# Altium project R Box.PrjPcb
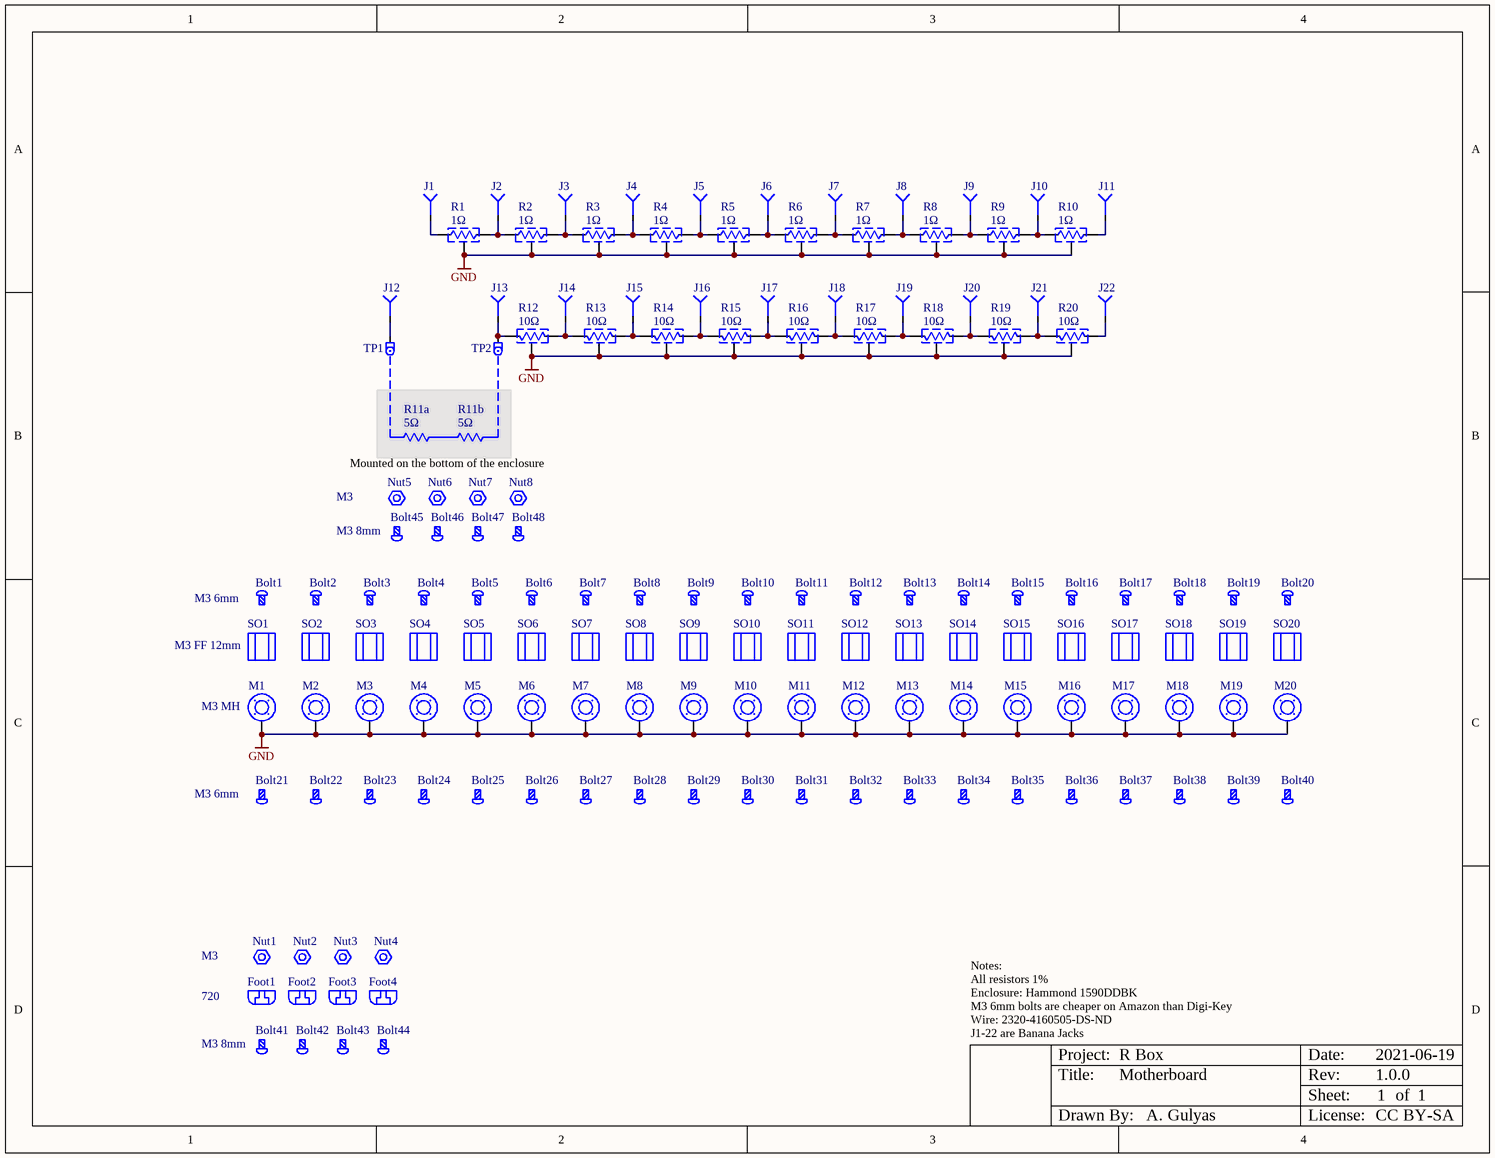
[diagram p0: R Box.SchDoc]
Revision: 1.0.0
1 sheet, 145 parts. Net scope: global (net labels, ports and power ports of the same name join across sheets).
Board file: R Box.PcbDoc

## Sheet R Box.SchDoc
size Letter; Revision: 1.0.0; SheetNumber: 1; SheetTotal: 1

### Parts
Bolt1  M3 6mm  [Mech - Bolt - M3 - 6mm]
Bolt2  M3 6mm  [Mech - Bolt - M3 - 6mm]  (value not drawn)
Bolt3  M3 6mm  [Mech - Bolt - M3 - 6mm]  (value not drawn)
Bolt4  M3 6mm  [Mech - Bolt - M3 - 6mm]  (value not drawn)
Bolt5  M3 6mm  [Mech - Bolt - M3 - 6mm]  (value not drawn)
Bolt6  M3 6mm  [Mech - Bolt - M3 - 6mm]  (value not drawn)
Bolt7  M3 6mm  [Mech - Bolt - M3 - 6mm]  (value not drawn)
Bolt8  M3 6mm  [Mech - Bolt - M3 - 6mm]  (value not drawn)
Bolt9  M3 6mm  [Mech - Bolt - M3 - 6mm]  (value not drawn)
Bolt10  M3 6mm  [Mech - Bolt - M3 - 6mm]  (value not drawn)
Bolt11  M3 6mm  [Mech - Bolt - M3 - 6mm]  (value not drawn)
Bolt12  M3 6mm  [Mech - Bolt - M3 - 6mm]  (value not drawn)
Bolt13  M3 6mm  [Mech - Bolt - M3 - 6mm]  (value not drawn)
Bolt14  M3 6mm  [Mech - Bolt - M3 - 6mm]  (value not drawn)
Bolt15  M3 6mm  [Mech - Bolt - M3 - 6mm]  (value not drawn)
Bolt16  M3 6mm  [Mech - Bolt - M3 - 6mm]  (value not drawn)
Bolt17  M3 6mm  [Mech - Bolt - M3 - 6mm]  (value not drawn)
Bolt18  M3 6mm  [Mech - Bolt - M3 - 6mm]  (value not drawn)
Bolt19  M3 6mm  [Mech - Bolt - M3 - 6mm]  (value not drawn)
Bolt20  M3 6mm  [Mech - Bolt - M3 - 6mm]  (value not drawn)
Bolt21  M3 6mm  [Mech - Bolt - M3 - 6mm - back]
Bolt22  M3 6mm  [Mech - Bolt - M3 - 6mm - back]  (value not drawn)
Bolt23  M3 6mm  [Mech - Bolt - M3 - 6mm - back]  (value not drawn)
Bolt24  M3 6mm  [Mech - Bolt - M3 - 6mm - back]  (value not drawn)
Bolt25  M3 6mm  [Mech - Bolt - M3 - 6mm - back]  (value not drawn)
Bolt26  M3 6mm  [Mech - Bolt - M3 - 6mm - back]  (value not drawn)
Bolt27  M3 6mm  [Mech - Bolt - M3 - 6mm - back]  (value not drawn)
Bolt28  M3 6mm  [Mech - Bolt - M3 - 6mm - back]  (value not drawn)
Bolt29  M3 6mm  [Mech - Bolt - M3 - 6mm - back]  (value not drawn)
Bolt30  M3 6mm  [Mech - Bolt - M3 - 6mm - back]  (value not drawn)
Bolt31  M3 6mm  [Mech - Bolt - M3 - 6mm - back]  (value not drawn)
Bolt32  M3 6mm  [Mech - Bolt - M3 - 6mm - back]  (value not drawn)
Bolt33  M3 6mm  [Mech - Bolt - M3 - 6mm - back]  (value not drawn)
Bolt34  M3 6mm  [Mech - Bolt - M3 - 6mm - back]  (value not drawn)
Bolt35  M3 6mm  [Mech - Bolt - M3 - 6mm - back]  (value not drawn)
Bolt36  M3 6mm  [Mech - Bolt - M3 - 6mm - back]  (value not drawn)
Bolt37  M3 6mm  [Mech - Bolt - M3 - 6mm - back]  (value not drawn)
Bolt38  M3 6mm  [Mech - Bolt - M3 - 6mm - back]  (value not drawn)
Bolt39  M3 6mm  [Mech - Bolt - M3 - 6mm - back]  (value not drawn)
Bolt40  M3 6mm  [Mech - Bolt - M3 - 6mm - back]  (value not drawn)
Bolt41  M3 8mm  [Mech - Bolt - M3 - 8mm]
Bolt42  M3 8mm  [Mech - Bolt - M3 - 8mm]  (value not drawn)
Bolt43  M3 8mm  [Mech - Bolt - M3 - 8mm]  (value not drawn)
Bolt44  M3 8mm  [Mech - Bolt - M3 - 8mm]  (value not drawn)
Bolt45  M3 8mm  [Mech - Bolt - M3 - 8mm]
Bolt46  M3 8mm  [Mech - Bolt - M3 - 8mm]  (value not drawn)
Bolt47  M3 8mm  [Mech - Bolt - M3 - 8mm]  (value not drawn)
Bolt48  M3 8mm  [Mech - Bolt - M3 - 8mm]  (value not drawn)
Foot1  720  [Feet - M3 - PN720]
Foot2  720  [Feet - M3 - PN720]  (value not drawn)
Foot3  720  [Feet - M3 - PN720]  (value not drawn)
Foot4  720  [Feet - M3 - PN720]  (value not drawn)
J1  Banana  [J - Banana - 108-09xx series]  (value not drawn)
J2  Banana  [J - Banana - 108-09xx series]  (value not drawn)
J3  Banana  [J - Banana - 108-09xx series]  (value not drawn)
J4  Banana  [J - Banana - 108-09xx series]  (value not drawn)
J5  Banana  [J - Banana - 108-09xx series]  (value not drawn)
J6  Banana  [J - Banana - 108-09xx series]  (value not drawn)
J7  Banana  [J - Banana - 108-09xx series]  (value not drawn)
J8  Banana  [J - Banana - 108-09xx series]  (value not drawn)
J9  Banana  [J - Banana - 108-09xx series]  (value not drawn)
J10  Banana  [J - Banana - 108-09xx series]  (value not drawn)
J11  Banana  [J - Banana - 108-09xx series]  (value not drawn)
J12  Banana  [J - Banana - 108-09xx series]  (value not drawn)
J13  Banana  [J - Banana - 108-09xx series]  (value not drawn)
J14  Banana  [J - Banana - 108-09xx series]  (value not drawn)
J15  Banana  [J - Banana - 108-09xx series]  (value not drawn)
J16  Banana  [J - Banana - 108-09xx series]  (value not drawn)
J17  Banana  [J - Banana - 108-09xx series]  (value not drawn)
J18  Banana  [J - Banana - 108-09xx series]  (value not drawn)
J19  Banana  [J - Banana - 108-09xx series]  (value not drawn)
J20  Banana  [J - Banana - 108-09xx series]  (value not drawn)
J21  Banana  [J - Banana - 108-09xx series]  (value not drawn)
J22  Banana  [J - Banana - 108-09xx series]  (value not drawn)
M1  M3 MH  [Bolt Hole - M3]  (no BOM)
M2  M3 MH  [Bolt Hole - M3]  (value not drawn)  (no BOM)
M3  M3 MH  [Bolt Hole - M3]  (value not drawn)  (no BOM)
M4  M3 MH  [Bolt Hole - M3]  (value not drawn)  (no BOM)
M5  M3 MH  [Bolt Hole - M3]  (value not drawn)  (no BOM)
M6  M3 MH  [Bolt Hole - M3]  (value not drawn)  (no BOM)
M7  M3 MH  [Bolt Hole - M3]  (value not drawn)  (no BOM)
M8  M3 MH  [Bolt Hole - M3]  (value not drawn)  (no BOM)
M9  M3 MH  [Bolt Hole - M3]  (value not drawn)  (no BOM)
M10  M3 MH  [Bolt Hole - M3]  (value not drawn)  (no BOM)
M11  M3 MH  [Bolt Hole - M3]  (value not drawn)  (no BOM)
M12  M3 MH  [Bolt Hole - M3]  (value not drawn)  (no BOM)
M13  M3 MH  [Bolt Hole - M3]  (value not drawn)  (no BOM)
M14  M3 MH  [Bolt Hole - M3]  (value not drawn)  (no BOM)
M15  M3 MH  [Bolt Hole - M3]  (value not drawn)  (no BOM)
M16  M3 MH  [Bolt Hole - M3]  (value not drawn)  (no BOM)
M17  M3 MH  [Bolt Hole - M3]  (value not drawn)  (no BOM)
M18  M3 MH  [Bolt Hole - M3]  (value not drawn)  (no BOM)
M19  M3 MH  [Bolt Hole - M3]  (value not drawn)  (no BOM)
M20  M3 MH  [Bolt Hole - M3]  (value not drawn)  (no BOM)
Nut1  M3  [Mech - Nut - M3]
Nut2  M3  [Mech - Nut - M3]  (value not drawn)
Nut3  M3  [Mech - Nut - M3]  (value not drawn)
Nut4  M3  [Mech - Nut - M3]  (value not drawn)
Nut5  M3  [Mech - Nut - M3]
Nut6  M3  [Mech - Nut - M3]  (value not drawn)
Nut7  M3  [Mech - Nut - M3]  (value not drawn)
Nut8  M3  [Mech - Nut - M3]  (value not drawn)
R1  1Ω  [R - PWR163]
R2  1Ω  [R - PWR163]
R3  1Ω  [R - PWR163]
R4  1Ω  [R - PWR163]
R5  1Ω  [R - PWR163]
R6  1Ω  [R - PWR163]
R7  1Ω  [R - PWR163]
R8  1Ω  [R - PWR163]
R9  1Ω  [R - PWR163]
R10  1Ω  [R - PWR163]
R11a  5Ω  [R - KAL50W]
R11b  5Ω  [R - KAL50W]
R12  10Ω  [R - PWR163]
R13  10Ω  [R - PWR163]
R14  10Ω  [R - PWR163]
R15  10Ω  [R - PWR163]
R16  10Ω  [R - PWR163]
R17  10Ω  [R - PWR163]
R18  10Ω  [R - PWR163]
R19  10Ω  [R - PWR163]
R20  10Ω  [R - PWR163]
SO1  M3 FF 12mm  [Mech - SO - M3 - FF - 12mm]
SO2  M3 FF 12mm  [Mech - SO - M3 - FF - 12mm]  (value not drawn)
SO3  M3 FF 12mm  [Mech - SO - M3 - FF - 12mm]  (value not drawn)
SO4  M3 FF 12mm  [Mech - SO - M3 - FF - 12mm]  (value not drawn)
SO5  M3 FF 12mm  [Mech - SO - M3 - FF - 12mm]  (value not drawn)
SO6  M3 FF 12mm  [Mech - SO - M3 - FF - 12mm]  (value not drawn)
SO7  M3 FF 12mm  [Mech - SO - M3 - FF - 12mm]  (value not drawn)
SO8  M3 FF 12mm  [Mech - SO - M3 - FF - 12mm]  (value not drawn)
SO9  M3 FF 12mm  [Mech - SO - M3 - FF - 12mm]  (value not drawn)
SO10  M3 FF 12mm  [Mech - SO - M3 - FF - 12mm]  (value not drawn)
SO11  M3 FF 12mm  [Mech - SO - M3 - FF - 12mm]  (value not drawn)
SO12  M3 FF 12mm  [Mech - SO - M3 - FF - 12mm]  (value not drawn)
SO13  M3 FF 12mm  [Mech - SO - M3 - FF - 12mm]  (value not drawn)
SO14  M3 FF 12mm  [Mech - SO - M3 - FF - 12mm]  (value not drawn)
SO15  M3 FF 12mm  [Mech - SO - M3 - FF - 12mm]  (value not drawn)
SO16  M3 FF 12mm  [Mech - SO - M3 - FF - 12mm]  (value not drawn)
SO17  M3 FF 12mm  [Mech - SO - M3 - FF - 12mm]  (value not drawn)
SO18  M3 FF 12mm  [Mech - SO - M3 - FF - 12mm]  (value not drawn)
SO19  M3 FF 12mm  [Mech - SO - M3 - FF - 12mm]  (value not drawn)
SO20  M3 FF 12mm  [Mech - SO - M3 - FF - 12mm]  (value not drawn)
TP1  Signal  [TP - TH - 4mm]  (value not drawn)  (no BOM)
TP2  Signal  [TP - TH - 4mm]  (value not drawn)  (no BOM)

### Nets
GND: M1.1 M2.1 M3.1 M4.1 M5.1 M6.1 M7.1 M8.1 M9.1 M10.1 M11.1 M12.1 M13.1 M14.1 M15.1 M16.1 M17.1 M18.1 M19.1 M20.1 R1.0 R2.0 R3.0 R4.0 R5.0 R6.0 R7.0 R8.0 R9.0 R10.0 R12.0 R13.0 R14.0 R15.0 R16.0 R17.0 R18.0 R19.0 R20.0
NetJ1_1: J1.1 R1.1
NetJ2_1: J2.1 R1.2 R2.1
NetJ3_1: J3.1 R2.2 R3.1
NetJ4_1: J4.1 R3.2 R4.1
NetJ5_1: J5.1 R4.2 R5.1
NetJ6_1: J6.1 R5.2 R6.1
NetJ7_1: J7.1 R6.2 R7.1
NetJ8_1: J8.1 R7.2 R8.1
NetJ9_1: J9.1 R8.2 R9.1
NetJ10_1: J10.1 R9.2 R10.1
NetJ11_1: J11.1 R10.2
NetJ12_1: J12.1 TP1.1
NetJ13_1: J13.1 R12.2 TP2.1
NetJ14_1: J14.1 R12.1 R13.2
NetJ15_1: J15.1 R13.1 R14.2
NetJ16_1: J16.1 R14.1 R15.2
NetJ17_1: J17.1 R15.1 R16.2
NetJ18_1: J18.1 R16.1 R17.2
NetJ19_1: J19.1 R17.1 R18.2
NetJ20_1: J20.1 R18.1 R19.2
NetJ21_1: J21.1 R19.1 R20.2
NetJ22_1: J22.1 R20.1

### Notes on the sheet
- Mounted on the bottom of the enclosure
- Notes:
  All resistors 1%
  Enclosure: Hammond 1590DDBK
  M3 6mm bolts are cheaper on Amazon than Digi-Key
  Wire: 2320-4160505-DS-ND
  J1-22 are Banana Jacks
- Project:
- Title:
- R Box
- Motherboard
- Date:
- Rev:
- Sheet:
- 2021-06-19
- of
- Drawn By:
- A. Gulyas
- License:
- CC BY-SA

### Library data of the parts
Bolt1-Bolt40 = Mech - Bolt - M3 - 6mm: MACH SCREW PAN HEAD PHILLIPS M3; MFG: APM Hexseal; MFG PN: RM3X6MM 2701; ComponentLink1Description: Datasheet; ComponentLink1URL: https://apmhexseal.com/wp-content/uploads/APMShortCatalog-HEX-SC-01-Rev.-06.19.19.pdf; ComponentLink2Description: Digi-Key; ComponentLink2URL: https://www.digikey.ca/en/products/detail/apm-hexseal/RM3X6MM-2701/612968; Digi-Key PN: 335-1156-ND
Bolt41-Bolt48 = Mech - Bolt - M3 - 8mm: MACH SCREW PAN HEAD PHILLIPS M3; MFG: B&F Fastener Supply; MFG PN: MPMS 003 0008 PH; ComponentLink1Description: Datasheet; ComponentLink1URL: http://www.fasnetdirect.com/refguide/MetD7985a.pdf; ComponentLink2Description: Digi-Key; ComponentLink2URL: https://www.digikey.ca/en/products/detail/b-f-fastener-supply/MPMS-003-0008-PH/274954; Digi-Key PN: H743-ND
Foot1-Foot4 = Feet - M3 - 720: BUMPER CYLINDRICAL 0.5" DIA BLK; MFG: Keystone Electronics; ComponentLink1Description: Datasheet; ComponentLink2Description: Digi-Key; Digi-Key PN: 36-720-ND; Height: 6.35mm; MFG PN: 720; Mounting Type: Bolt; Price/1 @10: $0.43; ComponentLink1URL: https://www.keyelco.com/userAssets/file/M65p134.pdf; ComponentLink2URL: https://www.digikey.ca/en/products/detail/keystone-electronics/720/61956
J1-J22 = Jack - Banana - 108-0904-001: CONN BANANA JACK SLDR TABS GREEN; Current Rating (Amps): 15 ADC; MFG: Cinch Connectivity Solutions Johnson; Op Temp: -55°C ~ 85°C; ComponentLink1Description: Datasheet; ComponentLink1URL: https://belfuse.com/resources/drawings/cinchconnectivitysolutions/johnson/dr-ccs-john-108-0904-001.pdf; ComponentLink2Description: Digi-Key; ComponentLink2URL: https://www.digikey.ca/en/products/detail/cinch-connectivity-solutions-johnson/108-0904-001/5931; Digi-Key PN: J153-ND; Insulation Color: Green; MFG PN: 108-0904-001; Mounting Type: Panel Mount; Price/1 @10: $1.099
M1-M20 = Mech - Bolt Hole - M3: M3 Mounting Pad
Nut1-Nut8 = Mech - Nut - M3: HEX NUT 0.217" STEEL M3; MFG: Keystone Electronics; MFG PN: 4708; ComponentLink1Description: Datasheet; ComponentLink1URL: https://www.keyelco.com/userAssets/file/M65p135.pdf; ComponentLink2Description: Digi-Key; ComponentLink2URL: https://www.digikey.ca/en/products/detail/keystone-electronics/4708/4499301; Composition: Steel; Digi-Key PN: 36-4708-ND; Height: 2.39mm; Price/1 @10: $0.1572
R1-R10 = R - SMT - 1Ω - 25W: RES SMD 1 OHM 1% 25W DPAK; MFG PN: PWR163S-25-1R00FE; MFG: Bourns Inc.; Temp Coeff: ±100ppm/°C; Op Temp: -55°C ~ 155°C; Digi-Key PN: 118-PWR163S-25-1R00FECT-ND; Price/1 @10: $4.59; Power: 25W; Value: 1Ω; Height: 3.17mm; Package: TO-252-3, DPak (2 Leads + Tab), SC-63; Composition: Thick Film; Tolerance: ±1%; Series: PWR163; Mounting Type: SMT; ComponentLink1Description: Datasheet; ComponentLink1URL: https://www.bourns.com/docs/Product-Datasheets/PWR163.pdf; ComponentLink2Description: Digi-Key; ComponentLink2URL: https://www.digikey.ca/en/products/detail/bourns-inc/PWR163S-25-1R00FE/4699561; Size: 8.13mm L x 8.22mm W
R11a R11b = R - PWR - 5Ω: RES CHAS MNT 5 OHM 1% 50W; MFG: Stackpole Electronics Inc; MFG PN: KAL50FB5R00; Op Temp: -55°C ~ 275°C; Temp Coeff: ±50ppm/°C; ComponentLink1Description: Datasheet; ComponentLink1URL: https://www.seielect.com/catalog/sei-kal.pdf; ComponentLink2Description: Digi-Key; ComponentLink2URL: https://www.digikey.ca/en/products/detail/stackpole-electronics-inc/KAL50FB5R00/1646198; Composition: Wirewound; Digi-Key PN: KAL50FB5R00-ND; Height: 16.28mm; Mounting Type: Chassis Mount; Package: Axial, Box; Power: 50W; Price/1 @10: $4.232; Series: KAL; Tolerance: ±1%; Value: 5Ω
R12-R20 = R - SMT - 10Ω - 25W: RES SMD 10 OHM 1% 25W DPAK; MFG PN: PWR163S-25-10R0F; MFG: Bourns Inc.; Temp Coeff: ±100ppm/°C; Op Temp: -55°C ~ 155°C; Digi-Key PN: PWR163S-25-10R0F-ND; Price/1 @10: $3.581; Power: 25W; Value: 10Ω; Height: 3.17mm; Package: TO-252-3, DPak (2 Leads + Tab), SC-63; Composition: Thick Film; Tolerance: ±1%; Series: PWR163; Mounting Type: SMT; ComponentLink1Description: Datasheet; ComponentLink1URL: https://www.bourns.com/docs/Product-Datasheets/PWR163.pdf; ComponentLink2Description: Digi-Key; ComponentLink2URL: https://www.digikey.ca/en/products/detail/bourns-inc/PWR163S-25-10R0F/2334147; Size: 8.13mm L x 8.22mm W
SO1-SO20 = Mech - SO - M3 - FF - 12mm: HEX STANDOFF M3 ALUMINUM 12MM; MFG: Keystone Electronics; MFG PN: 24434; ComponentLink1Description: Datasheet; ComponentLink1URL: https://www.keyelco.com/userAssets/file/M65p76.pdf; ComponentLink2Description: Digi-Key; ComponentLink2URL: https://www.digikey.ca/en/products/detail/keystone-electronics/24434/1532166; Digi-Key PN: 36-24434-ND
TP1 TP2 = TP - TH - 4mm